# EAGLE design camera_board (EAGLE 9.6.2)
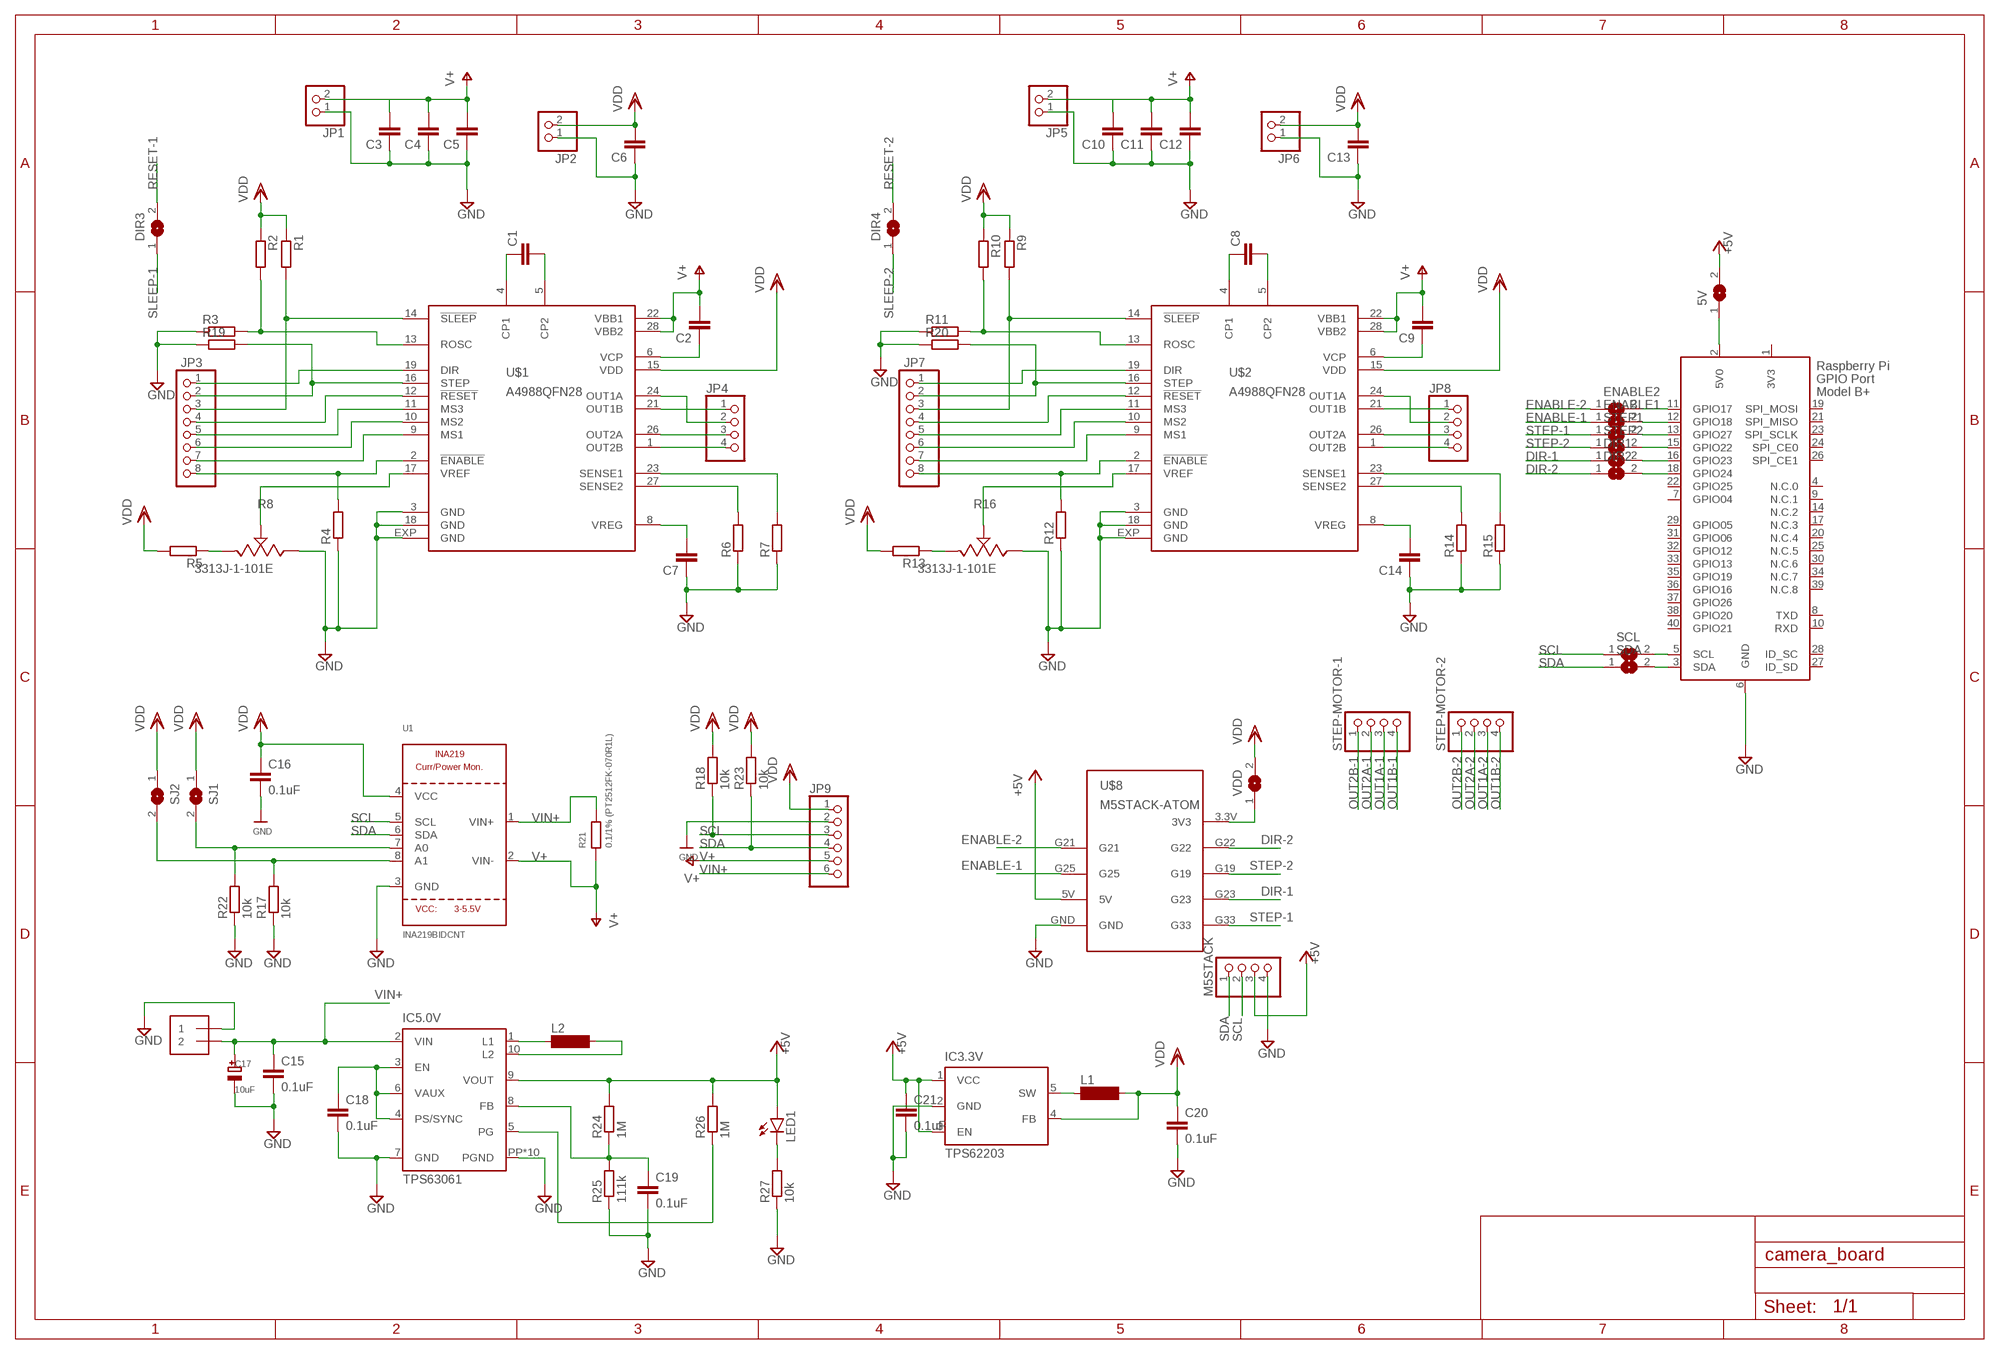
[diagram p0: schematic, sheet 1]

## Parts
5V  SOLDERJUMPERREFLOW_NOPASTE  [SOLDERJUMPER_REFLOW_NOPASTE]
7.5V  TERMBLOCK_1X2-3.5MM  [1X2-3.5MM]
C1  C-EUC0402  [C0402]
C2  C-EUC0402  [C0402]
C3  C-EUC1206  [C1206]
C4  C-EUC0402  [C0402]
C5  C-EUC0402  [C0402]
C6  C-EUC0402  [C0402]
C7  C-EUC0402  [C0402]
C8  C-EUC0402  [C0402]
C9  C-EUC0402  [C0402]
C10  C-EUC1206  [C1206]
C11  C-EUC0402  [C0402]
C12  C-EUC0402  [C0402]
C13  C-EUC0402  [C0402]
C14  C-EUC0402  [C0402]
C15  0.1uF  C-EUC0805  [C0805]
C16  0.1uF  C-EUC0402  [C0402]
C17  10uF  CAP_ELECTROLYTICPANASONIC_C  [PANASONIC_C]
C18  0.1uF  C-EUC0805  [C0805]
C19  0.1uF  C-EUC0805  [C0805]
C20  0.1uF  C-EUC0805  [C0805]
C21  0.1uF  C-EUC0805  [C0805]
DIR1  SOLDERJUMPERREFLOW_NOPASTE  [SOLDERJUMPER_REFLOW_NOPASTE]
DIR2  SOLDERJUMPERREFLOW_NOPASTE  [SOLDERJUMPER_REFLOW_NOPASTE]
DIR3  SOLDERJUMPERREFLOW_NOPASTE  [SOLDERJUMPER_REFLOW_NOPASTE]
DIR4  SOLDERJUMPERREFLOW_NOPASTE  [SOLDERJUMPER_REFLOW_NOPASTE]
ENABLE1  SOLDERJUMPERREFLOW_NOPASTE  [SOLDERJUMPER_REFLOW_NOPASTE]
ENABLE2  SOLDERJUMPERREFLOW_NOPASTE  [SOLDERJUMPER_REFLOW_NOPASTE]
IC3.3V  TPS62203  [SOT23-5]
IC5.0V  TPS63061  [DSC-S-PWSON-N10]
JP1  PINHD-1X2  [1X02]
JP2  PINHD-1X2  [1X02]
JP3  PINHD-1X8  [1X08]
JP4  PINHD-1X4  [1X04]
JP5  PINHD-1X2  [1X02]
JP6  PINHD-1X2  [1X02]
JP7  PINHD-1X8  [1X08]
JP8  PINHD-1X4  [1X04]
JP9  HEADER-1X670MIL  [1X06_ROUND_70]
L1  MS50  [MS50]
L2  MS50  [MS50]
LED1  LEDCHIPLED_0603  [CHIPLED_0603]
M5STACK  PINHD-1X4  [1X04]
R1  R-EU_R0402  [R0402]
R2  R-EU_R0402  [R0402]
R3  R-EU_R0402  [R0402]
R4  R-EU_R0402  [R0402]
R5  R-EU_R0402  [R0402]
R6  R-EU_R0603  [R0603]
R7  R-EU_R0603  [R0603]
R8  3313J-1-101E  [3313J-1-101E]
R9  R-EU_R0402  [R0402]
R10  R-EU_R0402  [R0402]
R11  R-EU_R0402  [R0402]
R12  R-EU_R0402  [R0402]
R13  R-EU_R0402  [R0402]
R14  R-EU_R0603  [R0603]
R15  R-EU_R0603  [R0603]
R16  3313J-1-101E  [3313J-1-101E]
R17  10k  R-EU_R0603  [R0603]
R18  10k  R-EU_R0603  [R0603]
R19  R-EU_R0805  [R0805]
R20  R-EU_R0805  [R0805]
R21  0.1/1% (PT2512FK-070R1L)  R-EU_R2512  [R2512]
R22  10k  R-EU_R0603  [R0603]
R23  10k  R-EU_R0603  [R0603]
R24  1M  R-EU_R0603  [R0603]
R25  111k  R-EU_R0603  [R0603]
R26  1M  R-EU_R0603  [R0603]
R27  10k  R-EU_R0603  [R0603]
SCL  SOLDERJUMPERREFLOW_NOPASTE  [SOLDERJUMPER_REFLOW_NOPASTE]
SDA  SOLDERJUMPERREFLOW_NOPASTE  [SOLDERJUMPER_REFLOW_NOPASTE]
SJ1  SOLDERJUMPERREFLOW_NOPASTE  [SOLDERJUMPER_REFLOW_NOPASTE]
SJ2  SOLDERJUMPERREFLOW_NOPASTE  [SOLDERJUMPER_REFLOW_NOPASTE]
STEP1  SOLDERJUMPERREFLOW_NOPASTE  [SOLDERJUMPER_REFLOW_NOPASTE]
STEP2  SOLDERJUMPERREFLOW_NOPASTE  [SOLDERJUMPER_REFLOW_NOPASTE]
STEP-MOTOR-1  PINHD-1X4  [1X04]
STEP-MOTOR-2  PINHD-1X4  [1X04]
U1  INA219BIDCNT  INA219  [SOT23-8]
U$1  A4988QFN28  [QFN28-ML_6X6MM]
U$2  A4988QFN28  [QFN28-ML_6X6MM]
U$8  M5STACK-ATOM  [M5STACK-ATOM]
VDD  SOLDERJUMPERREFLOW_NOPASTE  [SOLDERJUMPER_REFLOW_NOPASTE]
X1  RASPI_BOARD_B+_E4  [RASPI_BOARD_B+_EDGES_4DRILL]

## Nets
+5V: 5V.2 C21.1 IC3.3V.1(VCC) IC3.3V.3(EN) IC5.0V.9(VOUT) LED1.A M5STACK.3 R24.2 R26.2 U$8.5V
DIR-1: DIR1.1 JP3.1 U$1.19(DIR) U$8.G23
DIR-2: DIR2.1 JP7.1 U$2.19(DIR) U$8.G22
ENABLE-1: ENABLE1.1 JP3.8 R4.2 U$1.2(!ENABLE) U$8.G25
ENABLE-2: ENABLE2.1 JP7.8 R12.2 U$2.2(!ENABLE) U$8.G21
GND: 7.5V.1 C3.1 C4.1 C5.1 C6.1 C7.1 C10.1 C11.1 C12.1 C13.1 C14.1 C15.2 C16.2 C17.- C18.2 C19.2 C20.2 C21.2 IC3.3V.2(GND) IC5.0V.7(GND) IC5.0V.PP(PGND) IC5.0V.PP@1(PGND) IC5.0V.PP@2(PGND) IC5.0V.PP@3(PGND) IC5.0V.PP@4(PGND) IC5.0V.PP@5(PGND) IC5.0V.PP@7(PGND) IC5.0V.PP@8(PGND) IC5.0V.PP@9(PGND) IC5.0V.PP@10(PGND) JP1.1 JP2.1 JP5.1 JP6.1 JP9.2 M5STACK.4 R3.1 R4.1 R6.1 R7.1 R8.3 R11.1 R12.1 R14.1 R15.1 R16.3 R17.1 R19.1 R20.1 R22.1 R25.1 R27.1 U1.3(GND) U$1.3(GND) U$1.18(GND) U$1.EXP(GND) U$2.3(GND) U$2.18(GND) U$2.EXP(GND) U$8.GND X1.6(GND)
N$1: R2.2 R3.2 U$1.13(ROSC)
N$2: ENABLE2.2 X1.11(GPIO17)
N$3: JP3.5 U$1.11(MS3)
N$4: C18.1 IC5.0V.3(EN) IC5.0V.4(PS/SYNC) IC5.0V.6(VAUX)
N$5: IC5.0V.1(L1) L2.1
N$6: IC5.0V.10(L2) L2.2
N$7: JP3.6 U$1.10(MS2)
N$8: JP3.7 U$1.9(MS1)
N$9: C19.1 IC5.0V.8(FB) R24.1 R25.2
N$10: R8.2 U$1.17(VREF)
N$11: R5.1 R8.1
N$12: C2.1 U$1.6(VCP)
N$13: C7.2 U$1.8(VREG)
N$14: 5V.1 X1.2(5V0)
N$15: ENABLE1.2 X1.12(GPIO18)
N$16: IC5.0V.5(PG) R26.1
N$17: STEP1.2 X1.13(GPIO27)
N$18: R7.2 U$1.23(SENSE1)
N$19: R6.2 U$1.27(SENSE2)
N$20: C1.2 U$1.5(CP2)
N$21: C1.1 U$1.4(CP1)
N$22: R10.2 R11.2 U$2.13(ROSC)
N$23: STEP2.2 X1.15(GPIO22)
N$24: DIR1.2 X1.16(GPIO23)
N$25: DIR2.2 X1.18(GPIO24)
N$26: SCL.2 X1.5(SCL)
N$27: JP7.5 U$2.11(MS3)
N$28: JP7.6 U$2.10(MS2)
N$29: JP7.7 U$2.9(MS1)
N$30: SDA.2 X1.3(SDA)
N$31: R13.1 R16.1
N$32: R16.2 U$2.17(VREF)
N$33: C9.1 U$2.6(VCP)
N$34: IC3.3V.5(SW) L1.1
N$35: LED1.C R27.2
N$36: U$8.3.3V(3V3) VDD.1
N$38: R15.2 U$2.23(SENSE1)
N$39: R14.2 U$2.27(SENSE2)
N$40: C14.2 U$2.8(VREG)
N$41: C8.2 U$2.5(CP2)
N$42: C8.1 U$2.4(CP1)
N$43: R17.2 SJ2.2 U1.8(A1)
N$44: R22.2 SJ1.2 U1.7(A0)
OUT1A-1: JP4.2 STEP-MOTOR-1.3 U$1.24(OUT1A)
OUT1A-2: JP8.2 STEP-MOTOR-2.3 U$2.24(OUT1A)
OUT1B-1: JP4.1 STEP-MOTOR-1.4 U$1.21(OUT1B)
OUT1B-2: JP8.1 STEP-MOTOR-2.4 U$2.21(OUT1B)
OUT2A-1: JP4.3 STEP-MOTOR-1.2 U$1.26(OUT2A)
OUT2A-2: JP8.3 STEP-MOTOR-2.2 U$2.26(OUT2A)
OUT2B-1: JP4.4 STEP-MOTOR-1.1 U$1.1(OUT2B)
OUT2B-2: JP8.4 STEP-MOTOR-2.1 U$2.1(OUT2B)
RESET-1: DIR3.2 JP3.4 U$1.12(!RESET)
RESET-2: DIR4.2 JP7.4 U$2.12(!RESET)
SCL: JP9.3 M5STACK.2 R18.1 SCL.1 U1.5(SCL)
SDA: JP9.4 M5STACK.1 R23.1 SDA.1 U1.6(SDA)
SLEEP-1: DIR3.1 JP3.3 R1.2 U$1.14(!SLEEP)
SLEEP-2: DIR4.1 JP7.3 R9.2 U$2.14(!SLEEP)
STEP-1: JP3.2 R19.2 STEP1.1 U$1.16(STEP) U$8.G33
STEP-2: JP7.2 R20.2 STEP2.1 U$2.16(STEP) U$8.G19
V+: C2.2 C3.2 C4.2 C5.2 C9.2 C10.2 C11.2 C12.2 JP1.2 JP5.2 JP9.5 R21.1 U1.2(VIN-) U$1.22(VBB1) U$1.28(VBB2) U$2.22(VBB1) U$2.28(VBB2)
VDD: C6.2 C13.2 C16.1 C20.1 IC3.3V.4(FB) JP2.2 JP6.2 JP9.1 L1.2 R1.1 R2.1 R5.2 R9.1 R10.1 R13.2 R18.2 R23.2 SJ1.1 SJ2.1 U1.4(VCC) U$1.15(VDD) U$2.15(VDD) VDD.2
VIN+: 7.5V.2 C15.1 C17.+ IC5.0V.2(VIN) JP9.6 R21.2 U1.1(VIN+)
Unconnected: X1.4(N.C.0) X1.7(GPIO04) X1.8(TXD) X1.9(N.C.1) X1.10(RXD) X1.14(N.C.2) X1.17(N.C.3) X1.19(SPI_MOSI) X1.20(N.C.4) X1.21(SPI_MISO) X1.22(GPIO25) X1.23(SPI_SCLK) X1.24(SPI_CE0) X1.25(N.C.5) X1.26(SPI_CE1) X1.27(ID_SD) X1.28(ID_SC) X1.29(GPIO05) X1.30(N.C.6) X1.31(GPIO06) X1.32(GPIO12) X1.33(GPIO13) X1.34(N.C.7) X1.35(GPIO19) X1.36(GPIO16) X1.37(GPIO26) X1.38(GPIO20) X1.39(N.C.8) X1.40(GPIO21)

## Power pins joined to a net without a drawn wire
3V3: X1.1(3V3)

## Library data of the parts
5V DIR1-DIR4 ENABLE1 ENABLE2 SCL SDA SJ1 SJ2 STEP1 STEP2 VDD = microbuilder:SOLDERJUMPER: SMD Solder JUMPER Solder the two pads together to create a connection, or remove the solder to break it. REFLOW - Use this footprint for solder paste and reflow ovens. WAVE - Use this footprint for hand-soldering (larger pads). CLOSED - Has a trace between the two pads to ensure it is closed by default. The trace needs to be cut to disable the jumper, and can be closed again by creating a solder bridge between the two pads.
7.5V = microbuilder:TERMBLOCK_1X2: 3.5mm Terminal block http://www.ladyada.net/library/pcb/eaglelibrary.html
C1-C16 C18-C21 = rcl:C-EU: CAPACITOR, European symbol; SPICEPREFIX: C
C17 = microbuilder:CAP_ELECTROLYTIC: Electrolytic Capacitors SMT PANASONIC_C - Size C Panasonic Electrolytic Aluminum Capacitor 47µF 16V 20% Electrolytic Capacitor [Digikey: PCE3890TR-ND] PANASONIC_D - Size D Panasonic Electrolytic Aluminum Capacitor 100µF 25V 20% Electrolytic Capacitor [Digikey: PCE3898TR-ND] PTH 3.5 mm grid, 8 mm diameter ... 3.5 mm grid, 10 mm diameter ...
IC3.3V = lemariva:TPS62203
IC5.0V = texas:TPS6306*: HIGH INPUT VOLTAGE BUCK-BOOST CONVERTER WITH 2A SWITCH CURRENT Source: http://www.ti.com/lit/ds/symlink/tps63060.pdf
JP1 JP2 JP5 JP6 = pinhead:PINHD-1X2: PIN HEADER
JP3 JP7 = pinhead:PINHD-1X8: PIN HEADER
JP4 JP8 M5STACK STEP-MOTOR-1 STEP-MOTOR-2 = pinhead:PINHD-1X4: PIN HEADER
JP9 = microbuilder:HEADER-1X6: PIN HEADER
L1 L2 = inductor-neosid:MS50: INDUCTOR SMD power inductor; OC_FARNELL: unknown; OC_NEWARK: unknown
LED1 = led:LED: LED OSRAM: - CHIPLED LG R971, LG N971, LY N971, LG Q971, LY Q971, LO R971, LY R971 LH N974, LH R974 LS Q976, LO Q976, LY Q976 LO Q996 - Hyper CHIPLED LW Q18S LB Q993, LB Q99A, LB R99A - SideLED LS A670, LO A670, LY A670, LG A670, LP A670 LB A673, LV A673, LT A673, LW A673 LH A674 LY A675 LS A676, LA A676, LO A676, LY A676, LW A676 LS A679, LY A679, LG A679 - Hyper Micro SIDELED® LS Y876, LA Y876, LO Y876, LY Y876 LT Y87S - SmartLED LW L88C, LW L88S LB L89C, LB L89S, LG L890 LS L89K, LO L89K, LY L89K LS L896, LA L896, LO L896, LY L896 - TOPLED LS T670, LO T670, LY T670, LG T670, LP T670 LSG T670, LSP T670, LSY T670, LOP T670, LYG T670 LG T671, LOG T671, LSG T671 LB T673, LV T673, LT T673, LW T673 LH T674 LS T676, LA T676, LO T676, LY T676, LB T676, LH T676, LSB T676, LW T676 LB T67C, LV T67C, LT T67C, LS T67K, LO T67K, LY T67K, LW E67C LS E67B, LA E67B, LO E67B, LY E67B, LB E67C, LV E67C, LT E67C LW T67C LS T679, LY T679, LG T679 LS T770, LO T770, LY T770, LG T770, LP T770 LB T773, LV T773, LT T773, LW T773 LH T774 LS E675, LA E675, LY E675, LS T675 LS T776, LA T776, LO T776, LY T776, LB T776 LHGB T686 LT T68C, LB T68C - Hyper Mini TOPLED® LB M676 - Mini TOPLED Santana® LG M470 LS M47K, LO M47K, LY M47K Source: http://www.osram.convergy.de LUXEON: - LUMILED® LXK2-PW12-R00, LXK2-PW12-S00, LXK2-PW14-U00, LXK2-PW14-V00 LXK2-PM12-R00, LXK2-PM12-S00, LXK2-PM14-U00 LXK2-PE12-Q00, LXK2-PE12-R00, LXK2-PE12-S00, LXK2-PE14-T00, LXK2-PE14-U00 LXK2-PB12-K00, LXK2-PB12-L00, LXK2-PB12-M00, LXK2-PB14-N00, LXK2-PB14-P00, LXK2-PB14-Q00 LXK2-PR12-L00, LXK2-PR12-M00, LXK2-PR14-Q00, LXK2-PR14-R00 LXK2-PD12-Q00, LXK2-PD12-R00, LXK2-PD12-S00 LXK2-PH12-R00, LXK2-PH12-S00 LXK2-PL12-P00, LXK2-PL12-Q00, LXK2-PL12-R00 Source: www.luxeon.com KINGBRIGHT: KA-3528ASYC Source: www.kingbright.com
R1-R7 R9-R15 R17-R27 = rcl:R-EU_: RESISTOR, European symbol; SPICEPREFIX: R
R8 R16 = Potentiometer_Trimmers:3313J-1-101E: TRIMMER 100OHM 0.125W J LEAD TOP Manufacturer's datasheet <https://www.bourns.com/docs/Product-Datasheets/3313.pdf>; CREATED_BY: PCBLayout.com; DIGIKEY_PN: 3313J-101ETR-ND; MANUFACTURER: Bourns Inc.; MPN: 3313J-1-101E
U1 = microbuilder:INA219: INA219 - I2C Current/Power Monitor Voltage Range: 0-26V Accuracy: 0.5% Temperature: -40°C - 125°C
U$1 U$2 = lemariva:A4988
U$8 = lemariva:M5STACK-ATOM
X1 = raspberrypi_bastelstube_v13:RASPI_BOARD_B+: Raspberry Pi GPIO connector with markings for the outer dimensions of the Raspberry Pi board model B+ with different sets of drill holes or mounting pads

## Board
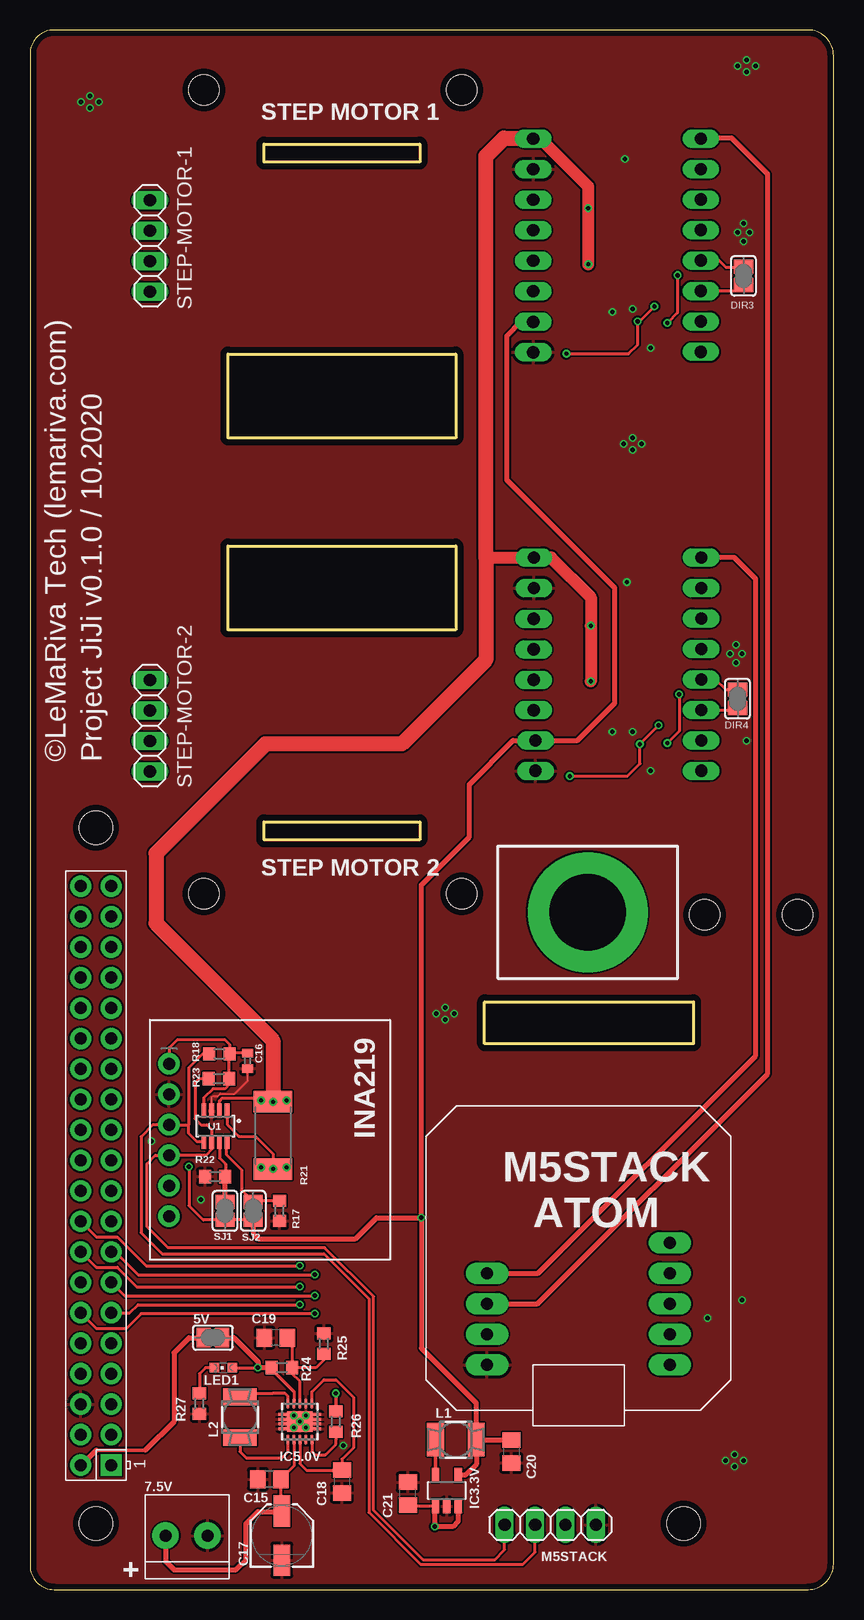
[diagram p1: board, top side]
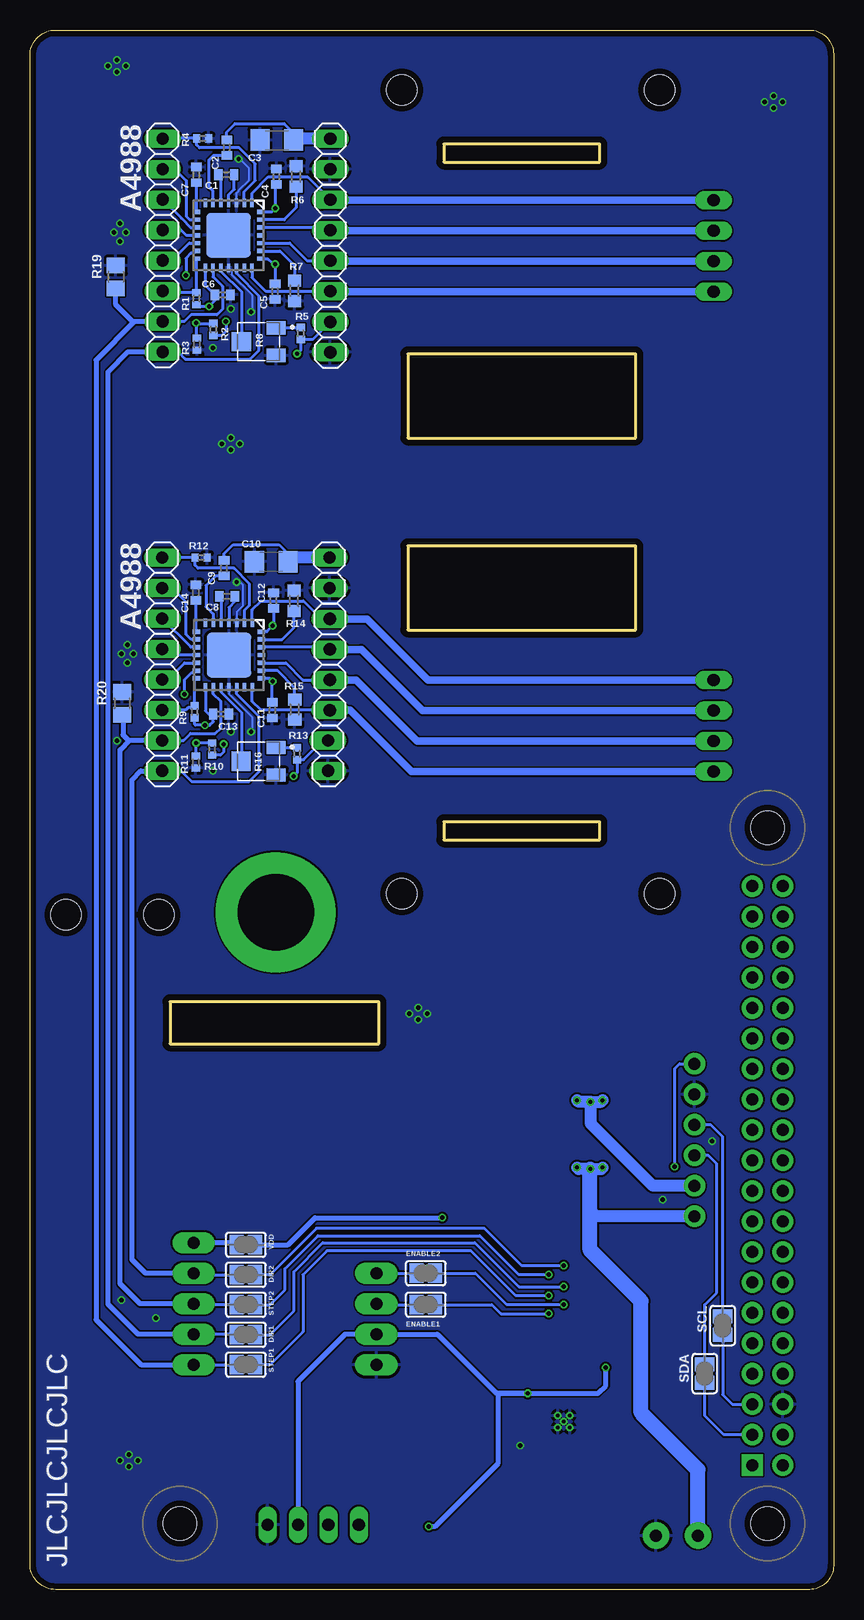
[diagram p2: board, bottom side, seen from below]

Size 67 x 130 mm. Coordinates in mm from the lower left corner, seen from the top.
Outline: 64.88,130 2,130 arc90 0,128 0,2 arc90 2,0 64.88,0 arc90 67,2.12 67,127.88 arc90 64.88,130
Outline: 55.33,45.5 37.9,45.5 37.9,49 55.33,49 55.33,45.5
Outline: 32.5,62.5 19.5,62.5 19.5,64 32.5,64 32.5,62.5
Outline: 35.5,80 16.5,80 16.5,87 35.5,87 35.5,80
Outline: 19.5,120.5 32.5,120.5 32.5,119 19.5,119 19.5,120.5
Outline: 16.5,103 35.5,103 35.5,96 16.5,96 16.5,103
Copper layers (1*16): Top 0.035mm / dielectric 1.6mm / Bottom 0.035mm
Design rules "Elecrow_2-layer_PCB_eagle_rule": minimum track width 6mil, minimum drill 12mil, track to track 6mil, track to pad 6mil, pad to pad 6mil, via to via 8mil, smd to smd 0mil, copper to edge 20mil, drill to drill 10mil, minimum pad ring 6mil, minimum via ring 6mil, stop-mask expansion 0mil, vias tented up to drill 100mil, thermal gap 10mil
Holes 2.5 mm at 14.5,125 14.5,58 36,125 36,58 56.25,56.25 64,56.25

### Footprints (pad centres in the part's own frame; a part is rotated, then mirrored left to right if it is on the bottom)
SOLDERJUMPER_REFLOW_NOPASTE = smd 1.168 x 1.6: 1 -0.762,0; 2 0.762,0
1X2-3.5MM = drill 1 pad 2.184: 1 1.8,0; 2 -1.7,0
C0402 = smd 0.7 x 0.9: 1 -0.65,0; 2 0.65,0
C1206 = smd 1.6 x 1.8: 1 -1.4,0; 2 1.4,0
C0805 = smd 1.3 x 1.5: 1 -0.95,0; 2 0.95,0
PANASONIC_C = smd 2.6 x 1.4: + 2.05,0; - -2.05,0
SOT23-5 = smd 0.6 x 1.2: 1 -0.95,-1.306; 2 0,-1.306; 3 0.95,-1.306; 4 0.95,1.306; 5 -0.95,1.306
DSC-S-PWSON-N10 = smd 0.28 x 0.85: 1 -1,-1.488; 2 -0.5,-1.488; 3 0,-1.488; 4 0.5,-1.488; 5 1,-1.488; 6 1,1.5; 7 0.5,1.5; 8 0,1.5; 9 -0.5,1.5; 10 -1,1.5 | smd 2.15 x 1.7: PP 0,0 | smd 3.55 x 0.25: PP@1 0,0.6; PP@2 0,0.2; PP@3 0,-0.2; PP@4 0,-0.6 | drill 0.3 pad 0.4: PP@5 -0.5,0.5; PP@7 0,0; PP@8 0.5,0.5; PP@9 -0.5,-0.5; PP@10 0.5,-0.5
1X02 = drill 1.016 long: 1 -1.27,0; 2 1.27,0
1X08 = drill 1.016 long: 1 -8.89,0; 2 -6.35,0; 3 -3.81,0; 4 -1.27,0; 5 1.27,0; 6 3.81,0; 7 6.35,0; 8 8.89,0
1X04 = drill 1.016 long: 1 -3.81,0; 2 -1.27,0; 3 1.27,0; 4 3.81,0
1X06_ROUND_70 = drill 1 pad 1.778: 1 -6.35,0; 2 -3.81,0; 3 -1.27,0; 4 1.27,0; 5 3.81,0; 6 6.35,0
MS50 = smd 2.8 x 1.4: 1 0,-1.7; 2 0,1.7
CHIPLED_0603 = smd 0.8 x 0.8: A 0,-0.75; C 0,0.75
R0402 = smd 0.6 x 0.7: 1 -0.5,0; 2 0.5,0
R0603 = smd 1 x 1.1: 1 -0.85,0; 2 0.85,0
3313J-1-101E = smd 1.1 x 1.6: 1 1.15,-1.45; 3 -1.15,-1.45 | smd 1.6 x 1.6: 2 0,1.45
R0805 = smd 1.3 x 1.5: 1 -0.95,0; 2 0.95,0
R2512 = smd 1.8 x 3.2: 1 -2.8,0; 2 2.8,0
SOT23-8 = smd 0.4 x 1.2: 1 -0.975,-1.3; 2 -0.325,-1.3; 3 0.325,-1.3; 4 0.975,-1.3; 5 0.975,1.3; 6 0.325,1.3; 7 -0.325,1.3; 8 -0.975,1.3
QFN28-ML_6X6MM = smd 0.7 x 0.35: 1 -2.7,1.95; 2 -2.7,1.3; 3 -2.7,0.65; 4 -2.7,0; 5 -2.7,-0.65; 6 -2.7,-1.3; 7 -2.7,-1.95; 15 2.7,-1.95; 16 2.7,-1.3; 17 2.7,-0.65; 18 2.7,0; 19 2.7,0.65; 20 2.7,1.3; 21 2.7,1.95 | smd 0.35 x 0.7: 8 -1.95,-2.7; 9 -1.3,-2.7; 10 -0.65,-2.7; 11 0,-2.7; 12 0.65,-2.7; 13 1.3,-2.7; 14 1.95,-2.7; 22 1.95,2.7; 23 1.3,2.7; 24 0.65,2.7; 25 0,2.7; 26 -0.65,2.7; 27 -1.3,2.7; 28 -1.95,2.7 | smd 3.7 x 3.7: EXP 0,0
M5STACK-ATOM = drill 1 pad 1.778 long: 3.3V 7.62,0; 5V -7.62,-7.62; G19 7.62,-5.08; G21 -7.62,-2.54; G22 7.62,-2.54; G23 7.62,-7.62; G25 -7.62,-5.08; G33 7.62,-10.16; GND -7.62,-10.16
RASPI_BOARD_B+_EDGES_4DRILL = drill 1 pad 1.778 square: 1 8.37,51.23 | drill 1 pad 1.778: 2 8.37,53.77; 3 10.91,51.23; 4 10.91,53.77; 5 13.45,51.23; 6 13.45,53.77; 7 15.99,51.23; 8 15.99,53.77; 9 18.53,51.23; 10 18.53,53.77; 11 21.07,51.23; 12 21.07,53.77; 13 23.61,51.23; 14 23.61,53.77; 15 26.15,51.23; 16 26.15,53.77; 17 28.69,51.23; 18 28.69,53.77; 19 31.23,51.23; 20 31.23,53.77; 21 33.77,51.23; 22 33.77,53.77; 23 36.31,51.23; 24 36.31,53.77; 25 38.85,51.23; 26 38.85,53.77; 27 41.39,51.23; 28 41.39,53.77; 29 43.93,51.23; 30 43.93,53.77; 31 46.47,51.23; 32 46.47,53.77; 33 49.01,51.23; 34 49.01,53.77; 35 51.55,51.23; 36 51.55,53.77; 37 54.09,51.23; 38 54.09,53.77; 39 56.63,51.23; 40 56.63,53.77 | hole 2.75: 3.5,3.5; 3.5,52.5; 61.5,52.5

### Placement (x,y rotation side)
5V  15.25,21 0 top
7.5V  13,4.5 0 top
C1  50.63,117.94 180 bottom
C2  50.59,120.19 90 bottom
C3  46.41,120.82 0 bottom
C4  46.45,117.77 270 bottom
C5  46.56,108.2 90 bottom
C6  50.94,107.92 180 bottom
C7  53.13,117.92 270 bottom
C8  50.57,82.78 180 bottom
C9  50.82,85.13 90 bottom
C10  46.89,85.67 0 bottom
C11  46.79,73.29 90 bottom
C12  46.7,82.44 270 bottom
C13  51.08,72.97 180 bottom
C14  53.17,83.1 270 bottom
C15  19.95,9.2 180 top
C16  18.15,44.07 270 top
C17  21,4.5 90 top
C18  26,9 270 top
C19  20.5,21 180 top
C20  40.12,11.5 270 top
C21  31.5,8 90 top
DIR1  49,21.25 0 bottom
DIR2  49,26.25 0 bottom
DIR3  59.5,109.5 90 top
DIR4  59,74.25 90 top
ENABLE1  34,23.75 0 bottom
ENABLE2  34,26.38 0 bottom
IC3.3V  34.75,8.25 0 top
IC5.0V  22.5,14 0 top
JP1  41.97,119.68 90 bottom
JP2  41.96,104.4 90 bottom
JP3  55.94,112.06 90 bottom
JP4  41.96,112.04 90 bottom
JP5  42.03,84.75 90 bottom
JP6  42.16,69.51 90 bottom
JP7  55.97,77.13 90 bottom
JP8  42,77.1 90 bottom
JP9  11.6,37.47 270 top
L1  35.5,12.5 270 top
L2  17.5,14.38 0 top
LED1  16.12,18.5 90 top
M5STACK  43.39,5.39 0 top
R1  53.11,107.61 90 bottom
R2  51.71,105.04 90 bottom
R3  53.08,103.8 90 bottom
R4  52.61,120.95 180 bottom
R5  44.43,104.7 270 bottom
R6  44.81,117.78 270 bottom
R7  44.94,108.26 90 bottom
R8  47.92,104.02 90 bottom
R9  53.27,73.16 90 bottom
R10  51.81,70.05 90 bottom
R11  53.17,68.97 90 bottom
R12  52.73,86.02 180 bottom
R13  44.73,69.67 270 bottom
R14  44.98,82.4 270 bottom
R15  44.92,73.36 90 bottom
R16  47.94,69.04 90 bottom
R17  20.8,31.57 90 top
R18  15.79,44.65 0 top
R19  59.84,109.41 270 bottom
R20  59.31,73.86 270 bottom
R21  20.26,37.85 270 top
R22  15.44,34.42 0 top
R23  15.76,42.58 0 top
R24  21,18.5 180 top
R25  24.5,20.5 270 top
R26  25.5,14 90 top
R27  14.12,15.5 90 top
SCL  9.25,22 270 bottom
SDA  10.75,18 270 bottom
SJ1  16.26,31.57 90 top
SJ2  18.61,31.57 90 top
STEP1  49,18.75 0 bottom
STEP2  49,23.75 0 bottom
STEP-MOTOR-1  10,112 270 top
STEP-MOTOR-2  10,72 270 top
U1  15.47,38.61 180 top
U$1  50.44,112.88 270 bottom
U$2  50.41,77.9 270 bottom
U$8  45.74,28.9 0 top
VDD  49,28.75 0 bottom
X1  58,2 90 top

### Tracks (layer width: path | path; a pad name or v marks a point on that pad's centre or on a via)
+5V  (via drill 0.35)
  Top 0.254: R24.2 20.15,18.35 | 22,16.5 IC5.0V.9 | 33.75,6.89 IC3.3V.1 31.61,6.94 C21.1 | LED1.A v19,18.5
  Top 0.305: 20.15,18.35 22,16.5 | v25.5,16.34 R26.2
  Top 0.406: R24.2 v19,18.5 19,19 17,21 5V.2 | 33.75,6.89 v33.75,5.25 35.25,5.25 35.7,5.7 IC3.3V.3
  Bottom 0.406: v25.5,16.34 19.66,16.34 19,17 v19,18.5 | v25.5,16.34 28.09,16.34 33.03,21.28 U$8.5V 40.72,21.28 44.66,17.34 M5STACK.3 | v25.5,16.34 28,16.34 28,10.5 33.25,5.25 v33.75,5.25
DIR-1
  Bottom 0.254: U$1.19 49.79,109.72 47.9,107.83 47.9,103.33 48.66,102.56 54.05,102.56 54.66,103.17 55.5,103.17 JP3.1 | DIR1.1 49.79,21.28 U$8.G23
  Bottom 0.406: U$8.G23 58,21.28 60.5,23.78 60.5,101.5 58.83,103.17 55.5,103.17
DIR-2
  Bottom 0.254: JP7.1 54.41,68.24 53.52,67.36 48.73,67.36 47.9,68.18 47.9,72.78 49.78,74.65 49.78,75.18 U$2.19 | U$8.G22 53.25,26.25 DIR2.1
  Bottom 0.406: U$8.G22 57.36,26.36 58.5,27.5 58.5,67.5 57.76,68.24 JP7.1
ENABLE-1
  Top 0.406: JP3.8 55.99,121 58.5,121 61.5,118 61.5,43 42.32,23.82 U$8.G25
  Bottom 0.254: JP3.8 55.9,120.98 53.13,120.98 R4.2 53.11,120.44 52.86,120.19 49.55,120.19 48.22,118.85 48.22,117.45 49.14,116.54 U$1.2 | U$8.G25 38.05,23.75 ENABLE1.1
ENABLE-2
  Top 0.406: JP7.8 58.73,86.02 60.5,84.25 60.5,44.5 42.36,26.36 U$8.G21
  Bottom 0.254: JP7.8 R12.2 53.23,85.38 52.98,85.14 50,85.14 48.7,83.83 48.7,82.06 49.11,81.64 U$2.2 | U$8.G21 38.1,26.38 ENABLE2.1
GND  (via drill 0.35)
  Top 0.152: U1.3 15.14,41.04 15.25,41.14 15.69,41.14 15.87,41.32 17.07,41.32 18.15,42.4 C16.2
  Bottom 0.152: U$1.3 49.79,116.4 49.62,116.57 49.62,116.63 48.75,117.5 48.75,118.5 49.5,119.25 v49.61,119.25 | U$2.3 49.77,81.49 49.25,82 49.25,83.75 49.5,84 49.75,84 v49.77,83.98 | U$2.18 50.41,74.66 48.5,72.75 48.5,71.5 v48.56,71.5 | U$1.18 50.19,109.94 50.19,109.62 48.5,107.92 48.5,106.5 v48.56,106.5
  other vias: 51.75,103.5 50.25,106.75 50.25,71.5 51.75,68.25 5,124.5 4.25,124 5.75,124 5,123.5 59.75,127.5 59,127 60.5,127 59.75,126.5 34.62,48.5 33.88,48 35.38,48 34.62,47.5 50.25,96 49.5,95.5 51,95.5 50.25,95 58.75,11.25 58,10.75 59.5,10.75 58.75,10.25 14.25,32.5 10.12,37.38 26.12,12 56.5,22.62 59.38,24.12 59.75,70.75 58.38,78 58.88,77.25 58.88,78.75 59.38,78 59,113.12 59.5,112.38 59.5,113.88 60,113.12
  pour Top: 0,2 0,128 arc-90 2,130 64.88,130 arc-90 67,127.88 67,2.12 arc-90 64.88,0 2,0 arc-90
  pour Bottom: 64.88,0 2,0 arc-90 0,2 0,128 arc-90 2,130 64.88,130 arc-90 67,127.88 67,2.12 arc-90
N$1  (via drill 0.35)
  Top 0.254: v54,109.55 54,106.44 v53.14,105.58
  Bottom 0.254: U$1.13 53.34,111.39 53.59,111.39 54,110.97 v54,109.55 | R3.2 53.14,104.37 v53.14,105.58 53.1,105.54 R2.2
N$2  (via drill 0.35)
  Top 0.254: X1.11 8.32,23.07 9,23.75 v22.5,23.75
  Bottom 0.254: v22.5,23.75 27.25,23.75 29.88,26.38 ENABLE2.2
N$3
  Bottom 0.254: JP3.5 54.41,113.33 53.97,112.88 U$1.11 | U$1.11
N$4
  Top 0.254: IC5.0V.4 IC5.0V.3 22.5,10.5 23.05,9.95 C18.1 26,10.88 27,11.88 27,16 25.5,17.5 24.5,17.5 23.5,16.5 IC5.0V.6
N$5
  Top 0.254: IC5.0V.1 21.5,11.5 21,11 18,11 17.5,11.5 L2.1
N$6
  Top 0.254: IC5.0V.10 21.5,16.12 21.25,16.38 20.25,16.38 17.8,16.38 L2.2
N$7
  Bottom 0.254: JP3.6 54.37,114.31 54.37,114.3 53.6,113.53 U$1.10
N$8
  Bottom 0.254: JP3.7 54.92,118.41 53.97,117.45 53.97,114.47 53.68,114.18 U$1.9
N$9
  Top 0.254: R24.1 21.85,18 22.5,17.35 IC5.0V.8 | R25.2 24.5,19.15 23.85,18.5 R24.1 | C19.1 21.85,20.6 R24.1
N$10
  Bottom 0.254: U$1.17 51.09,109.92 49.37,108.19 R8.2
N$11
  Bottom 0.254: R8.1 46.44,105.2 R5.1
N$12
  Bottom 0.254: U$1.6 51.74,116.59 52.06,116.92 52.06,119.17 51.69,119.54 C2.1
N$13
  Bottom 0.254: C7.2 U$1.8
N$14
  Top 0.305: 4.28,10.37 X1.2 | 9.62,11.62 5.53,11.62
  Top 0.406: 9.62,11.62 12,14 12,19.75 13.25,21 5V.1 | 5.53,11.62 4.28,10.37
N$15  (via drill 0.35)
  Top 0.254: v23.75,23 9.25,23 8,21.75 5.55,21.75 X1.12
  Bottom 0.254: ENABLE1.2 28.5,23.75 27.75,23 v23.75,23
N$16
  Top 0.254: R26.1 25.5,12.75 25.5,12.5 25.5,12.12 24.62,11.25 23.75,11.25 23.5,11.5 IC5.0V.5
N$17  (via drill 0.35)
  Top 0.254: X1.13 7.88,24.5 v23.75,24.5
  Bottom 0.254: STEP1.2 47,18.75 44.25,21.5 44.25,26.25 42.25,28.25 30.25,28.25 26.5,24.5 v23.75,24.5
N$18
  Bottom 0.254: U$1.23 46.16,111.58 44.94,110.36 R7.2
N$19
  Bottom 0.254: R6.2 44.81,115.18 45.81,114.18 U$1.27
N$20
  Bottom 0.254: C1.2 51.09,117.75 U$1.5
N$21
  Bottom 0.254: U$1.4 50.44,116.25 49.98,116.72 C1.1
N$22  (via drill 0.35)
  Top 0.254: v54.13,74.62 54.13,71.55 v53.14,70.56
  Bottom 0.254: U$2.13 53.31,76.4 53.56,76.4 54.13,75.83 v54.13,74.62 | R11.2 53.17,70.53 v53.14,70.56 v53.13,70.55 R10.2
N$23  (via drill 0.35)
  Top 0.254: 7.1,28.15 9,26.25 v23.75,26.25
  Top 0.406: X1.15 7.1,28.15
  Bottom 0.254: v23.75,26.25 26.25,26.25 29.5,29.5 43,29.5 45.75,26.75 45.75,25 47,23.75 STEP2.2
N$24  (via drill 0.35)
  Top 0.254: X1.16 5.53,26.86 7.29,26.86 8.89,25.25 v22.5,25.25
  Bottom 0.254: v22.5,25.25 26.25,25.25 29.91,28.91 42.59,28.91 45,26.5 45,23.25 47,21.25 DIR1.2
N$25  (via drill 0.35)
  Top 0.254: X1.18 5.53,29.39 7.29,29.39 9.68,27 v22.5,27
  Bottom 0.254: v22.5,27 26,27 29.12,30.12 43.12,30.12 47,26.25 DIR2.2
N$26
  Bottom 0.254: SCL.2 9.25,16.25 8.45,15.45 X1.5
N$27
  Bottom 0.254: JP7.5 55.46,77.89 U$2.11
N$28
  Bottom 0.254: U$2.10 53.57,78.55 JP7.6
N$29
  Bottom 0.254: JP7.7 55.14,83.48 53.97,82.31 53.97,79.61 53.55,79.19 U$2.9
N$30
  Bottom 0.254: X1.3 9.16,12.91 10.75,14.5 SDA.2
N$31
  Bottom 0.254: R16.1 44.74,70.19 R13.1
N$32
  Bottom 0.254: U$2.17 51.06,74.8 49.36,73.1 49.36,69.06 R16.2
N$33
  Bottom 0.254: C9.1 51.54,84.48 52.32,83.71 52.32,81.93 51.71,81.32 U$2.6
N$34
  Top 0.305: IC3.3V.5 L1.1
N$35
  Top 0.254: LED1.C 14.62,18.5 14.12,18 R27.2
N$36
  Bottom 0.254: VDD.1 49.91,28.9
  Bottom 0.406: 49.91,28.9 U$8.3.3V
N$38
  Bottom 0.254: R15.2 44.92,75.17 46.35,76.6 U$2.23
N$39
  Bottom 0.254: U$2.27 45.97,79.19 44.98,80.18 R14.2
N$40
  Bottom 0.254: C14.2 53.17,79.91 U$2.8
N$41
  Bottom 0.254: C8.2 51.06,82.63 U$2.5
N$42
  Bottom 0.254: C8.1 49.92,82.36 50.41,81.86 U$2.4
N$43
  Top 0.254: U1.8 16.39,37.26 16.39,36.23 17.63,34.99 17.63,33.31 SJ2.2 18.7,32.42 R17.2
N$44
  Top 0.254: U1.7 15.79,35.97 16.3,35.47 R22.2 16.26,34.4
  Top 0.406: SJ1.2 16.26,34.4 R22.2
N$45  (via drill 6.35 pad 10)
  other vias: 46.51,56.45
OUT1A-1
  Bottom 0.254: U$1.24 45.35,112.23 43.88,110.77 JP4.2
  Bottom 0.61: JP4.2 41.92,110.73 STEP-MOTOR-1.3
OUT1A-2
  Bottom 0.254: U$2.24 45.67,77.25 44.25,75.83 JP8.2
  Bottom 0.61: JP8.2 39.83,75.83 34.73,70.73 STEP-MOTOR-2.3
OUT1B-1
  Bottom 0.254: U$1.21 48.49,109.37 47.34,108.22 41.97,108.22 JP4.1
  Bottom 0.61: JP4.1 41.92,108.19 STEP-MOTOR-1.4
OUT1B-2
  Bottom 0.254: U$2.21 48.46,74.04 47.71,73.29 JP8.1
  Bottom 0.61: JP8.1 40.29,73.29 35.19,68.19 STEP-MOTOR-2.4
OUT2A-1
  Bottom 0.254: JP4.3 41.98,113.31 42.2,113.53 U$1.26
  Bottom 0.61: JP4.3 41.92,113.27 STEP-MOTOR-1.2
OUT2A-2
  Bottom 0.254: JP8.3 42.19,78.56 47.7,78.56 U$2.26
  Bottom 0.61: JP8.3 39.37,78.37 34.27,73.27 STEP-MOTOR-2.2
OUT2B-1
  Bottom 0.254: U$1.1 48.49,116.39 47.13,117.75 43.86,117.75 JP4.4
  Bottom 0.61: STEP-MOTOR-1.1 41.92,115.81 JP4.4
OUT2B-2
  Bottom 0.254: U$2.1 48.46,81.69 47.73,82.42 44.2,82.42 42.7,80.91 JP8.4
  Bottom 0.61: JP8.4 38.91,80.91 33.81,75.81 STEP-MOTOR-2.1
RESET-1
  Top 0.254: JP3.4 57.46,110.79 58,110.25 59.49,110.25 DIR3.2
  Bottom 0.254: JP3.4 55.17,110.79 53.73,112.23 U$1.12
RESET-2
  Top 0.254: JP7.4 57.15,75.86 58,75.01 DIR4.2
  Bottom 0.254: JP7.4 55.49,75.86 54.11,77.25 U$2.12
SCL
  Top 0.254: R18.1 14.4,44.65 13.25,43.5 13.25,38.75 | U1.5 13.94,37.31 13.25,38 13.25,38.75 | 13.25,38.75 13.24,38.74 JP9.3 10.24,38.74 9.25,37.75 9.25,29.75 11,28 24.5,28 28.25,24.25 28.25,6.42 32.58,2.09 41.09,2.09 42.12,3.12 M5STACK.2
  Bottom 0.254: JP9.3 11.59,38.75 10.25,38.75 9.25,37.75 SCL.1
SDA
  Top 0.254: R23.1 14.08,42.58 13.75,42.25 13.75,39.25 14.25,38.75 14.75,38.75 15.14,38.36 U1.6 15.14,36.67 14.68,36.2 JP9.4 10.45,36.2 9.75,35.5 9.75,30.25 11.5,28.5 24.57,28.5 28.66,24.42 28.66,6.59 32.75,2.5 38.75,2.5 39.58,3.33 M5STACK.1
  Bottom 0.254: JP9.4 10.45,36.2 9.75,35.5 9.75,24.75 10.75,23.75 SDA.1
SLEEP-1
  Top 0.254: DIR3.1 59.01,108.25 JP3.3
  Bottom 0.254: U$1.14 53.14,108.14 R1.2 55.8,108.11 JP3.3
SLEEP-2
  Top 0.254: JP7.3 58.84,73.32 DIR4.1
  Bottom 0.254: U$2.14 53.27,75.79 R9.2 53.43,73.51 53.81,73.51 53.99,73.32 JP7.3
STEP-1
  Bottom 0.254: JP3.2 54.13,105.71 53.57,106.27 51.41,106.27 50.96,106.72 50.96,108.64 51.74,109.42 U$1.16 | U$8.G33 49.78,18.74 STEP1.1
  Bottom 0.406: U$8.G33 57.74,18.74 61.5,22.5 61.5,102.5 58.29,105.71 JP3.2 58.46,105.71 59.84,107.09 R19.2
STEP-2
  Bottom 0.254: JP7.2 54.19,70.78 53.62,71.36 51.55,71.36 51.08,71.83 51.08,74.02 51.71,74.66 U$2.16 | U$8.G19 53.29,23.75 STEP2.1
  Bottom 0.406: U$8.G19 57.82,23.82 59.5,25.5 59.5,70 58.72,70.78 JP7.2 58.78,70.78 59.25,71.25 59.25,72.85 R20.2
V+  (via drill 0.35)
  Top 0.254: U1.2 15.79,40.75 16.01,40.97 19.95,40.97 R21.1
  Top 0.305: 46.54,110.47 v46.56,110.47
  Top 1.016: 46.54,110.47 v46.54,115.14 46.54,116.98 42.57,120.95 JP1.2 41.91,121 | v46.76,75.7 v46.76,80.34 46.76,82.72 43.46,86.02 JP5.2 38,86.02
  Top 1.27: 41.91,121 39.5,121 38,119.5 38,86.02 38,77.5 31,70.5 19.62,70.5 10.5,61.38 10.5,55.53 20.26,45.76 R21.1
  Bottom 0.254: U$1.28 46.84,114.83 v46.54,115.14 46.54,117.03 C4.2 | U$1.22 47.17,110.93 46.7,110.47 v46.56,110.47 C5.2 | C2.2 50.59,121.5 49.9,122.19 45.81,122.19 45.01,121.39 C3.2 | U$2.22 47,75.94 v46.76,75.7 46.79,75.67 C11.2 | C12.2 46.7,80.4 v46.76,80.34 47.26,79.85 U$2.28 | C9.2 50.82,86.34 50.06,87.1 46.25,87.1 45.17,86.02
  Bottom 1.016: JP1.2 44.88,120.95 C3.2 | JP5.2 45.14,86.02 | 45.14,86.02 45.17,86.02 | 45.14,86.02 C10.2 | JP9.5 15.05,33.66 20.26,38.87 R21.1 | R21.1 19.39,40.65 v19.26,40.78 | R21.1 21.26,40.65 v21.39,40.78
  other vias: 20.26,40.65
VDD  (via drill 0.35)
  Top 0.254: v52.07,106.95 50.67,105.55 | v50.67,105.71 50.67,105.55 | v44.73,103.01 49.9,103.01 50.67,103.77 50.67,105.55 | v45.01,67.8 49.81,67.8 50.86,68.85 v50.86,70.47 52.41,72.02 v52.41,72.04 | JP9.1 11.6,45.15 12.3,45.85 16.23,45.85 16.64,45.45 R18.2 | C16.1 16.71,44.72 R18.2 | R18.2 16.61,44.62 R23.2 16.61,42.1 16.25,41.75 15.25,41.75 14.49,40.99 U1.4 | SJ2.1 SJ1.1 14.45,30.8 13.25,32 v13.25,35.25 | 37.25,12.45 L1.2
  Top 0.406: IC3.3V.4 36.31,9.56 37.25,10.5 37.25,12.45 C20.1 | L1.2 37.2,15.55 32.62,20.12 v32.62,31 | JP2.2 40.92,105.67 39.75,104.5 39.75,92.5 48.75,83.5 48.75,73.88 45.66,70.78 42.5,70.78 JP6.2 40.28,70.78 36.62,67.12 36.62,62.75 32.62,58.75 v32.62,31 | SJ2.1 18.61,29.64 19,29.25 27.12,29.25 28.88,31 v32.62,31
  Bottom 0.254: R1.1 52.95,106.95 v52.07,106.95 51.59,107.44 C6.2 52.39,108.72 U$1.15 | v50.67,105.71 50.67,104.88 51.02,104.53 R2.1 | v44.73,103.01 44.43,103.31 R5.2 43.43,104.2 JP2.2 | U$2.15 52.36,73.24 52.09,72.97 C13.2 51.73,72.32 52.01,72.04 v52.41,72.04 53.2,72.04 53.27,72.12 R9.1 | JP6.2 42.57,70.78 44.18,69.17 R13.2 44.73,68.08 v45.01,67.8 | v50.86,70.47 50.86,69.8 51.11,69.55 R10.1 | v13.25,35.25 13.25,43.42 12.85,43.82 JP9.1
  Bottom 0.406: VDD.2 45.5,28.75 43.25,31 v32.62,31
VIN+  (via drill 0.35)
  Top 0.254: U1.1 16.44,38.75 17.41,37.79 18.8,37.79 20.26,36.33 R21.2 | IC5.0V.2 22,10.3 C15.1 20.9,6.65 | 20.9,6.65 20.9,6.5 | 20.9,6.65 C17.+
  Top 0.406: 7.5V.2 11.3,2.34 12,1.64 17.14,1.64 18,2.5 18,5.5 19,6.5 20.9,6.5
  Bottom 1.016: JP9.6 19.89,31.12 20.3,31.53 | 20.3,35.03 R21.2 | R21.2 21.26,35.05 v21.39,35.18 | R21.2 19.39,35.05 v19.26,35.18
  Bottom 1.27: 7.5V.2 11.3,10 16.05,14.75 16.05,24.05 20.3,28.3 20.3,31.53 20.3,35.03
  other vias: 20.26,35.05

### Text on the board
tNames: STEP MOTOR 1 | ©LeMaRiva Tech (lemariva.com) | Project JiJi v0.1.0 / 10.2020 | STEP MOTOR 2 | INA219 | +
bNames: A4988 | A4988 | JLCJLCJLCJLC